# Altium schematic sheet FDCAN.SchDoc: CAN FD
size A4; CompanyName: STMicroelectronics; Organization: Microcontrollers Division; DocumentNumber: 18; SheetNumber: 8; SheetTotal: 19
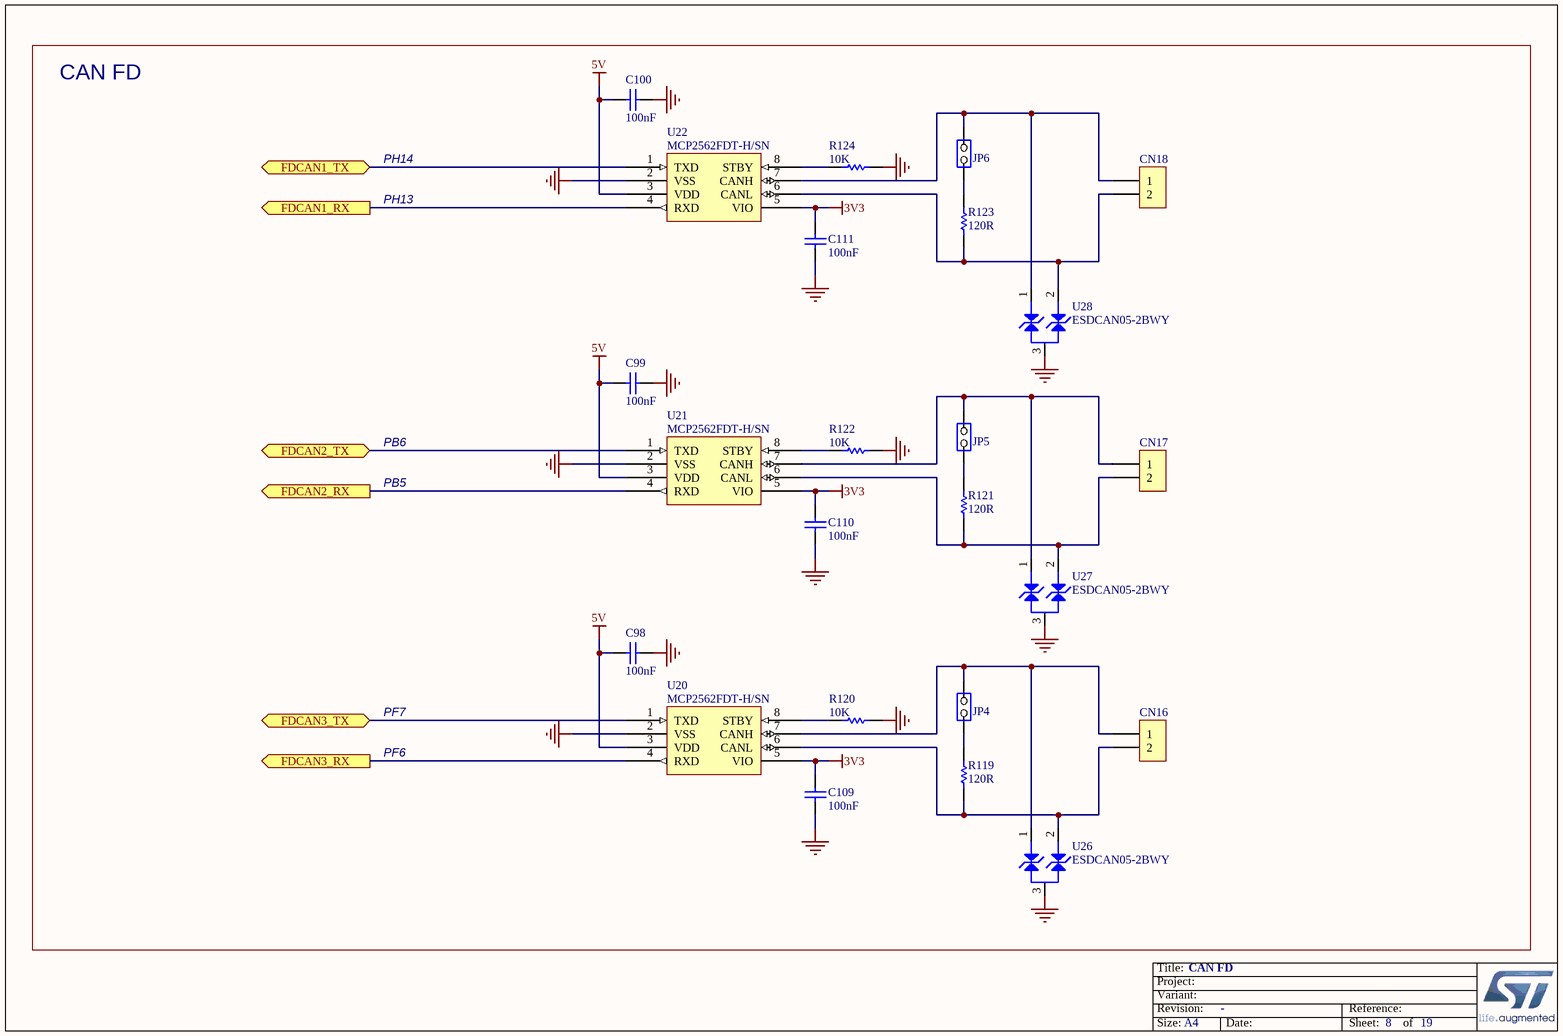
[diagram p0: FDCAN.SchDoc]

## Parts
C98  value 100nF  [C0402]  (hidden comment: Capacitor)
C99  value 100nF  [C0402]  (hidden comment: Capacitor)
C100  value 100nF  [C0402]  (hidden comment: Capacitor)
C109  value 100nF  [C0402]  (hidden comment: Capacitor)
C110  value 100nF  [C0402]  (hidden comment: Capacitor)
C111  value 100nF  [C0402]  (hidden comment: Capacitor)
CN16  Header 2x1  [CON_988-JIUBABA_PHFS25-11-02-G0B115-T-1]  (value not drawn)
CN17  Header 2x1  [CON_988-JIUBABA_PHFS25-11-02-G0B115-T-1]  (value not drawn)
CN18  Header 2x1  [CON_988-JIUBABA_PHFS25-11-02-G0B115-T-1]  (value not drawn)
JP4  Jumper_Header 2x1  [CON_SAMTEC_TSW-102-07-G-S]  (value not drawn)
JP5  Jumper_Header 2x1  [CON_SAMTEC_TSW-102-07-G-S]  (value not drawn)
JP6  Jumper_Header 2x1  [CON_SAMTEC_TSW-102-07-G-S]  (value not drawn)
R119  value 120R  [R0402]  (hidden comment: Resistor)
R120  value 10K  [R0402]  (hidden comment: Resistor)
R121  value 120R  [R0402]  (hidden comment: Resistor)
R122  value 10K  [R0402]  (hidden comment: Resistor)
R123  value 120R  [R0402]  (hidden comment: Resistor)
R124  value 10K  [R0402]  (hidden comment: Resistor)
U20  value MCP2562FDT-H/SN  [ICC_SO8_5X4_P127]  (hidden comment: MCP2562FD)
U21  value MCP2562FDT-H/SN  [ICC_SO8_5X4_P127]  (hidden comment: MCP2562FD)
U22  value MCP2562FDT-H/SN  [ICC_SO8_5X4_P127]  (hidden comment: MCP2562FD)
U26  value ESDCAN05-2BWY  [DIO_SOT323]  (hidden comment: ESD-TRANSIL-DUAL-BIDIR)
U27  value ESDCAN05-2BWY  [DIO_SOT323]  (hidden comment: ESD-TRANSIL-DUAL-BIDIR)
U28  value ESDCAN05-2BWY  [DIO_SOT323]  (hidden comment: ESD-TRANSIL-DUAL-BIDIR)

## Ports
FDCAN1_RX (out), FDCAN1_TX, FDCAN2_RX (out), FDCAN2_TX, FDCAN3_RX (out), FDCAN3_TX

## Nets
3V3: C109.2 C110.2 C111.2 U20.5(VIO) U21.5(VIO) U22.5(VIO)
5V: C98.2 C99.2 C100.2 U20.3(VDD) U21.3(VDD) U22.3(VDD)
GND: C98.1 C99.1 C100.1 C109.1 C110.1 C111.1 R120.2 R122.2 R124.2 U20.2(VSS) U21.2(VSS) U22.2(VSS) U26.3 U27.3 U28.3
FDCAN1_RX: U22.4(RXD) ; port FDCAN1_RX
FDCAN1_TX: U22.1(TXD) ; port FDCAN1_TX
FDCAN2_RX: U21.4(RXD) ; port FDCAN2_RX
FDCAN2_TX: U21.1(TXD) ; port FDCAN2_TX
FDCAN3_RX: U20.4(RXD) ; port FDCAN3_RX
FDCAN3_TX: U20.1(TXD) ; port FDCAN3_TX
NetCN16_1: CN16.1 JP4.2(NO) U20.7(CANH) U26.1
NetCN16_2: CN16.2 R119.1 U20.6(CANL) U26.2
NetCN17_1: CN17.1 JP5.2(NO) U21.7(CANH) U27.1
NetCN17_2: CN17.2 R121.1 U21.6(CANL) U27.2
NetCN18_1: CN18.1 JP6.2(NO) U22.7(CANH) U28.1
NetCN18_2: CN18.2 R123.1 U22.6(CANL) U28.2
NetJP4_1: JP4.1(COMMON) R119.2
NetJP5_1: JP5.1(COMMON) R121.2
NetJP6_1: JP6.1(COMMON) R123.2
NetR120_1: R120.1 U20.8(STBY)
NetR122_1: R122.1 U21.8(STBY)
NetR124_1: R124.1 U22.8(STBY)

## Notes on the sheet
- CAN FD
- PH14
- PH13
- PB6
- PB5
- PF7
- PF6
- Title:
- Project:
- Size:
- Revision:
- Variant:
- A4
- -
- Date:
- Reference:
- Sheet:
- of

## Library data of the parts
C98-C100 C109-C111 = MCD-00102: Capacitor, MLCC, 100nF, 16V, X7R, 10%, 0402, T=0,5mm; Manufacturer_Part_Number: CC0402KRX7R7BB104; Manufacturer: YAGEO; Alternate_Manufacturer_Part_Number: GCM155R71C104KA55D; Alternate_Manufacturer: MURATA; Provided_By: SUBCO; Internal_Part_Number: MCD-00102; Status: Released; Part_Type: Capacitor; Package: C0402; ComponentLink1Description: Datasheet; ComponentLink1URL: http://tunmcdsvn.tun.st.com/Component_Datasheet_Library/Trunk/Capacitors/Yageo_Multilayer_Capacitor_X7R_series_100pF_to_22uF
CN16-CN18 = MCD-00314: Header, 2x1, 2.54mm, VR, TH, Height 6mm/3mm; Part_Type: Connector; Manufacturer_Part_Number: PHFS25-11-02-G0B115-T-1; Manufacturer: JIUBABA; Provided_By: SUBCO; Internal_Part_Number: MCD-00314; Value: header 2x1; Status: Released; ComponentLink1Description: Datasheet; ComponentLink1URL: http://tunmcdsvn.tun.st.com/Component_Datasheet_Library/Trunk/Connectors/Jiubaba_PHFS25_11XXXXXXXXXX
JP4-JP6 = MCD-00045: Header, 2x1, 2,54mm, VR, TH, Height 5.84mm/2.54mm; Manufacturer_Part_Number: TSW-102-07-x-S; Manufacturer: SAMTEC; Part_Type: Connector; Alternate_Manufacturer_Part_Number: 313102S111116; Alternate_Manufacturer: JIUBABA; Value: Shunt not fitted; Provided_By: SUBCO; Internal_Part_Number: MCD-00045; Status: Released; ComponentLink1Description: Datasheet; ComponentLink1URL: http://tunmcdsvn.tun.st.com/Component_Datasheet_Library/Trunk/Connectors/Samtec_TSW-HTSW-series
R119 R121 R123 = MCD-00194: Resistor,120R,0402,1%,1/16W; Manufacturer_Part_Number: RC0402FR-07120RL; Manufacturer: YAGEO; Provided_By: SUBCO; Internal_Part_Number: MCD-00194; Status: Released; Part_Type: Resistor; Package: R0402; ComponentLink1Description: Datasheet; ComponentLink1URL: http://tunmcdsvn.tun.st.com/Component_Datasheet_Library/Trunk/Resistors/Yageo_Resistor_RC0402-series
R120 R122 R124 = MCD-00053: Resistor,10K,0402,1%,1/16W; Manufacturer_Part_Number: RC0402FR-0710KL; Manufacturer: YAGEO; Provided_By: SUBCO; Internal_Part_Number: MCD-00053; Status: Released; Part_Type: Resistor; Package: R0402; ComponentLink1Description: Datasheet; ComponentLink1URL: http://tunmcdsvn.tun.st.com/Component_Datasheet_Library/Trunk/Resistors/Yageo_Resistor_RC0402-series
U20-U22 = MCD-00129: High-Speed CAN Flexible Data Rate Transceiver; Part_Type: IC; Manufacturer: MICROCHIP; Provided_By: SUBCO; Internal_Part_Number: MCD-00129; Status: Released; Manufacturer_Part_Number: MCP2562FDT-H/SN; ComponentLink1Description: Datasheet; ComponentLink1URL: http://tunmcdsvn.tun.st.com/Component_Datasheet_Library/Trunk/IC/Microchip_CAN Transceiver_MCP2562FD
U26-U28 = MCD-01358: Automotive dual-line Transil, transient voltage suppressor (TVS) for CAN bus 36V. Compliant with interfaces in automotive: CAN-FD, LIN, FlexRay, MOST, SENT, USB; Part_Type: Diode; Manufacturer: STMICROELECTRONICS; BMS_Part_Number: 9179021; ECCN_US: EAR99; ECCN_EU: NEC; Provided_By: SUBCO with ST control; Internal_Part_Number: MCD-01358; Status: Released; Manufacturer_Part_Number: ESDCAN05-2BWY; Package: SOT323-3L; ComponentLink1Description: Datasheet; ComponentLink1URL: http://tunmcdsvn.tun.st.com/Component_Datasheet_Library/Trunk/Diodes/STM_ESD_ESDCAN02-2BWY